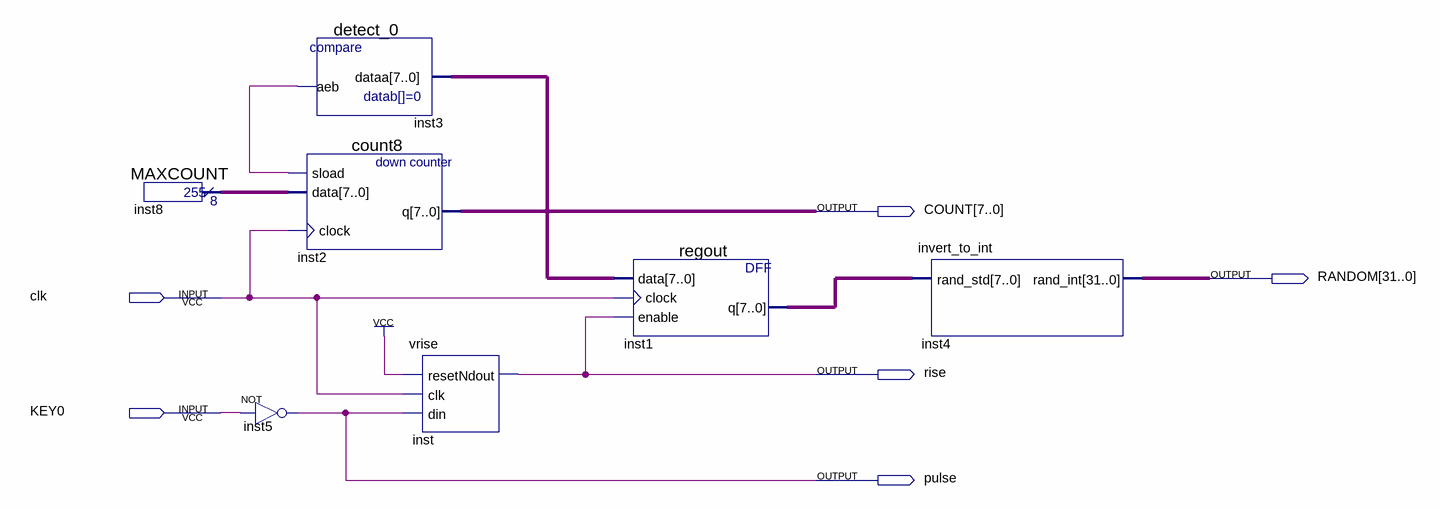
[diagram p0: schematic sheet]
// Quartus schematic hw_debug.bdf as structural Verilog: 7 symbols, 6 pins
module hw_debug (
  input  clk,
  input  KEY0,
  output [7:0] COUNT,
  output [31:0] RANDOM,
  output rise,
  output pulse
);

  wire inst3_aeb;
  wire [7:0] inst1_q, inst8_result;

  MAXCOUNT inst8 (.result(inst8_result));
  detect_0 inst3 (.dataa(COUNT), .aeb(inst3_aeb));
  count8 inst2 (.sload(inst3_aeb), .data(inst8_result), .clock(clk), .q(COUNT));
  not inst5 (pulse, KEY0);
  vrise inst (.resetN(1'b1), .clk(clk), .din(pulse), .dout(rise));
  regout inst1 (.data(COUNT), .clock(clk), .enable(rise), .q(inst1_q));
  invert_to_int inst4 (.rand_std(inst1_q), .rand_int(RANDOM));
endmodule
